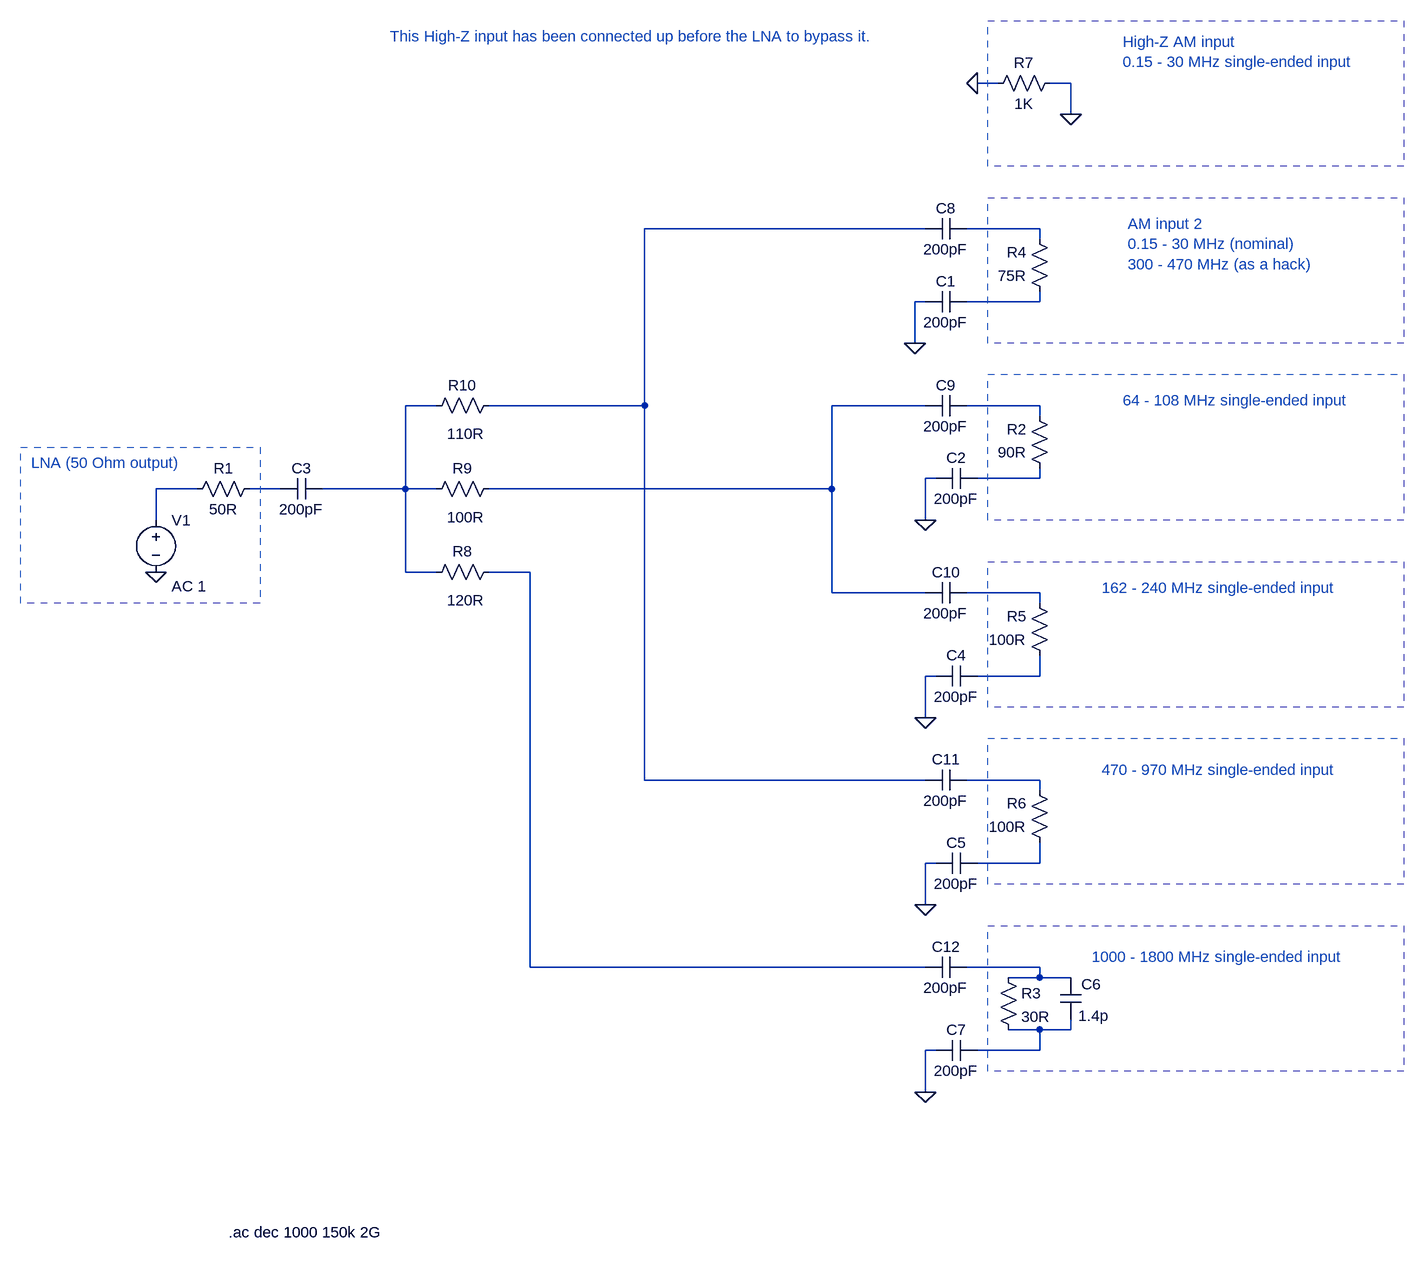
[diagram p0: schematic antenna_input_coupling_resistive_2.asc]
antenna_input_coupling_resistive_2.asc, the LTspice schematic file:
Version 4
SHEET 1 1332 1656
WIRE 464 -128 432 -128
WIRE 576 -128 544 -128
WIRE 576 -80 576 -128
WIRE 352 96 -80 96
WIRE 528 96 416 96
WIRE 528 112 528 96
WIRE 352 208 336 208
WIRE 528 208 528 192
WIRE 528 208 416 208
WIRE 336 272 336 208
WIRE -400 368 -448 368
WIRE -80 368 -80 96
WIRE -80 368 -320 368
WIRE 352 368 208 368
WIRE 528 368 416 368
WIRE 528 384 528 368
WIRE 368 480 352 480
WIRE 528 480 528 464
WIRE 528 480 432 480
WIRE -768 496 -832 496
WIRE -640 496 -688 496
WIRE -448 496 -448 368
WIRE -448 496 -576 496
WIRE -400 496 -448 496
WIRE 208 496 208 368
WIRE 208 496 -320 496
WIRE -832 544 -832 496
WIRE 352 544 352 480
WIRE -448 624 -448 496
WIRE -400 624 -448 624
WIRE -256 624 -320 624
WIRE 208 656 208 496
WIRE 352 656 208 656
WIRE 528 656 416 656
WIRE 528 672 528 656
WIRE 368 784 352 784
WIRE 528 784 528 752
WIRE 528 784 432 784
WIRE 352 848 352 784
WIRE -80 944 -80 368
WIRE 352 944 -80 944
WIRE 528 944 416 944
WIRE 528 960 528 944
WIRE 368 1072 352 1072
WIRE 528 1072 528 1040
WIRE 528 1072 432 1072
WIRE 352 1136 352 1072
WIRE -256 1232 -256 624
WIRE 352 1232 -256 1232
WIRE 528 1232 416 1232
WIRE 528 1248 528 1232
WIRE 528 1248 480 1248
WIRE 576 1248 528 1248
WIRE 528 1328 480 1328
WIRE 576 1328 576 1312
WIRE 576 1328 528 1328
WIRE 368 1360 352 1360
WIRE 528 1360 528 1328
WIRE 528 1360 432 1360
WIRE 352 1424 352 1360
FLAG -832 624 0
FLAG 336 272 0
FLAG 576 -80 0
FLAG 432 -128 0
FLAG 352 544 0
FLAG 352 848 0
FLAG 352 1136 0
FLAG 352 1424 0
SYMBOL res -672 480 R90
WINDOW 0 0 56 VBottom 2
WINDOW 3 32 56 VTop 2
SYMATTR InstName R1
SYMATTR Value 50R
SYMBOL voltage -832 528 R0
WINDOW 123 24 118 Left 2
SYMATTR Value2 AC 1
SYMATTR InstName V1
SYMATTR Value ""
SYMBOL res 544 480 R180
WINDOW 0 36 76 Left 2
WINDOW 3 36 40 Left 2
SYMATTR InstName R2
SYMATTR Value 90R
SYMBOL res 544 768 R180
WINDOW 0 36 76 Left 2
WINDOW 3 36 40 Left 2
SYMATTR InstName R5
SYMATTR Value 100R
SYMBOL res 544 1056 R180
WINDOW 0 36 76 Left 2
WINDOW 3 36 40 Left 2
SYMATTR InstName R6
SYMATTR Value 100R
SYMBOL res 464 1232 R0
SYMATTR InstName R3
SYMATTR Value 30R
SYMBOL res 544 208 R180
WINDOW 0 36 76 Left 2
WINDOW 3 36 40 Left 2
SYMATTR InstName R4
SYMATTR Value 75R
SYMBOL res 560 -144 R90
WINDOW 0 0 56 VBottom 2
WINDOW 3 32 56 VTop 2
SYMATTR InstName R7
SYMATTR Value 1K
SYMBOL cap 592 1312 R180
WINDOW 0 -31 54 Left 2
WINDOW 3 -43 5 Left 2
SYMATTR InstName C6
SYMATTR Value 1.4p
SYMBOL cap -576 480 R90
WINDOW 0 0 32 VBottom 2
WINDOW 3 32 32 VTop 2
SYMATTR InstName C3
SYMATTR Value 200pF
SYMBOL cap 416 192 R90
WINDOW 0 0 32 VBottom 2
WINDOW 3 32 32 VTop 2
SYMATTR InstName C1
SYMATTR Value 200pF
SYMBOL cap 432 464 R90
WINDOW 0 0 32 VBottom 2
WINDOW 3 32 32 VTop 2
SYMATTR InstName C2
SYMATTR Value 200pF
SYMBOL cap 432 768 R90
WINDOW 0 0 32 VBottom 2
WINDOW 3 32 32 VTop 2
SYMATTR InstName C4
SYMATTR Value 200pF
SYMBOL cap 432 1056 R90
WINDOW 0 0 32 VBottom 2
WINDOW 3 32 32 VTop 2
SYMATTR InstName C5
SYMATTR Value 200pF
SYMBOL cap 432 1344 R90
WINDOW 0 0 32 VBottom 2
WINDOW 3 32 32 VTop 2
SYMATTR InstName C7
SYMATTR Value 200pF
SYMBOL cap 416 80 R90
WINDOW 0 0 32 VBottom 2
WINDOW 3 32 32 VTop 2
SYMATTR InstName C8
SYMATTR Value 200pF
SYMBOL cap 416 352 R90
WINDOW 0 0 32 VBottom 2
WINDOW 3 32 32 VTop 2
SYMATTR InstName C9
SYMATTR Value 200pF
SYMBOL cap 416 640 R90
WINDOW 0 0 32 VBottom 2
WINDOW 3 32 32 VTop 2
SYMATTR InstName C10
SYMATTR Value 200pF
SYMBOL cap 416 928 R90
WINDOW 0 0 32 VBottom 2
WINDOW 3 32 32 VTop 2
SYMATTR InstName C11
SYMATTR Value 200pF
SYMBOL cap 416 1216 R90
WINDOW 0 0 32 VBottom 2
WINDOW 3 32 32 VTop 2
SYMATTR InstName C12
SYMATTR Value 200pF
SYMBOL res -304 608 R90
WINDOW 0 0 56 VBottom 2
WINDOW 3 44 51 VTop 2
SYMATTR InstName R8
SYMATTR Value 120R
SYMBOL res -304 480 R90
WINDOW 0 0 56 VBottom 2
WINDOW 3 44 51 VTop 2
SYMATTR InstName R9
SYMATTR Value 100R
SYMBOL res -304 352 R90
WINDOW 0 0 56 VBottom 2
WINDOW 3 44 51 VTop 2
SYMATTR InstName R10
SYMATTR Value 110R
TEXT -720 1640 Left 2 !.ac dec 1000 150k 2G
TEXT -1024 456 Left 2 ;LNA (50 Ohm output)
TEXT 656 360 Left 2 ;64 - 108 MHz single-ended input
TEXT 624 648 Left 2 ;162 - 240 MHz single-ended input
TEXT 624 928 Left 2 ;470 - 970 MHz single-ended input
TEXT 608 1216 Left 2 ;1000 - 1800 MHz single-ended input
TEXT 664 88 Left 2 ;AM input 2\n0.15 - 30 MHz (nominal)\n300 - 470 MHz (as a hack)
TEXT 656 -192 Left 2 ;High-Z AM input\n0.15 - 30 MHz single-ended input
TEXT -472 -200 Left 2 ;This High-Z input has been connected up before the LNA to bypass it.
RECTANGLE Normal -1040 432 -672 672 2
RECTANGLE Normal 1088 544 448 320 2
RECTANGLE Normal 1088 832 448 608 2
RECTANGLE Normal 1088 1104 448 880 2
RECTANGLE Normal 1088 1392 448 1168 2
RECTANGLE Normal 1088 272 448 48 2
RECTANGLE Normal 1088 0 448 -224 2

The netlist it stands for:
* antenna_input_coupling_resistive_2.asc
R1 N009 N008 50R
V1 N008 0 AC 1
R2 N007 N006 90R
R5 N012 N011 100R
R6 N014 N013 100R
R3 N015 N016 30R
R4 N003 N002 75R
R7 0 0 1K
C6 N016 N015 1.4p
C3 N004 N009 200pF
C1 N003 0 200pF
C2 N007 0 200pF
C4 N012 0 200pF
C5 N014 0 200pF
C7 N016 0 200pF
C8 N002 N001 200pF
C9 N006 N005 200pF
C10 N011 N005 200pF
C11 N013 N001 200pF
C12 N015 N010 200pF
R8 N010 N004 120R
R9 N005 N004 100R
R10 N001 N004 110R
.ac dec 1000 150k 2G
* LNA (50 Ohm output)
* 64 - 108 MHz single-ended input
* 162 - 240 MHz single-ended input
* 470 - 970 MHz single-ended input
* 1000 - 1800 MHz single-ended input
* AM input 2
* 0.15 - 30 MHz (nominal)
* 300 - 470 MHz (as a hack)
* High-Z AM input
* 0.15 - 30 MHz single-ended input
* This High-Z input has been connected up before the LNA to bypass it.
.backanno
.end